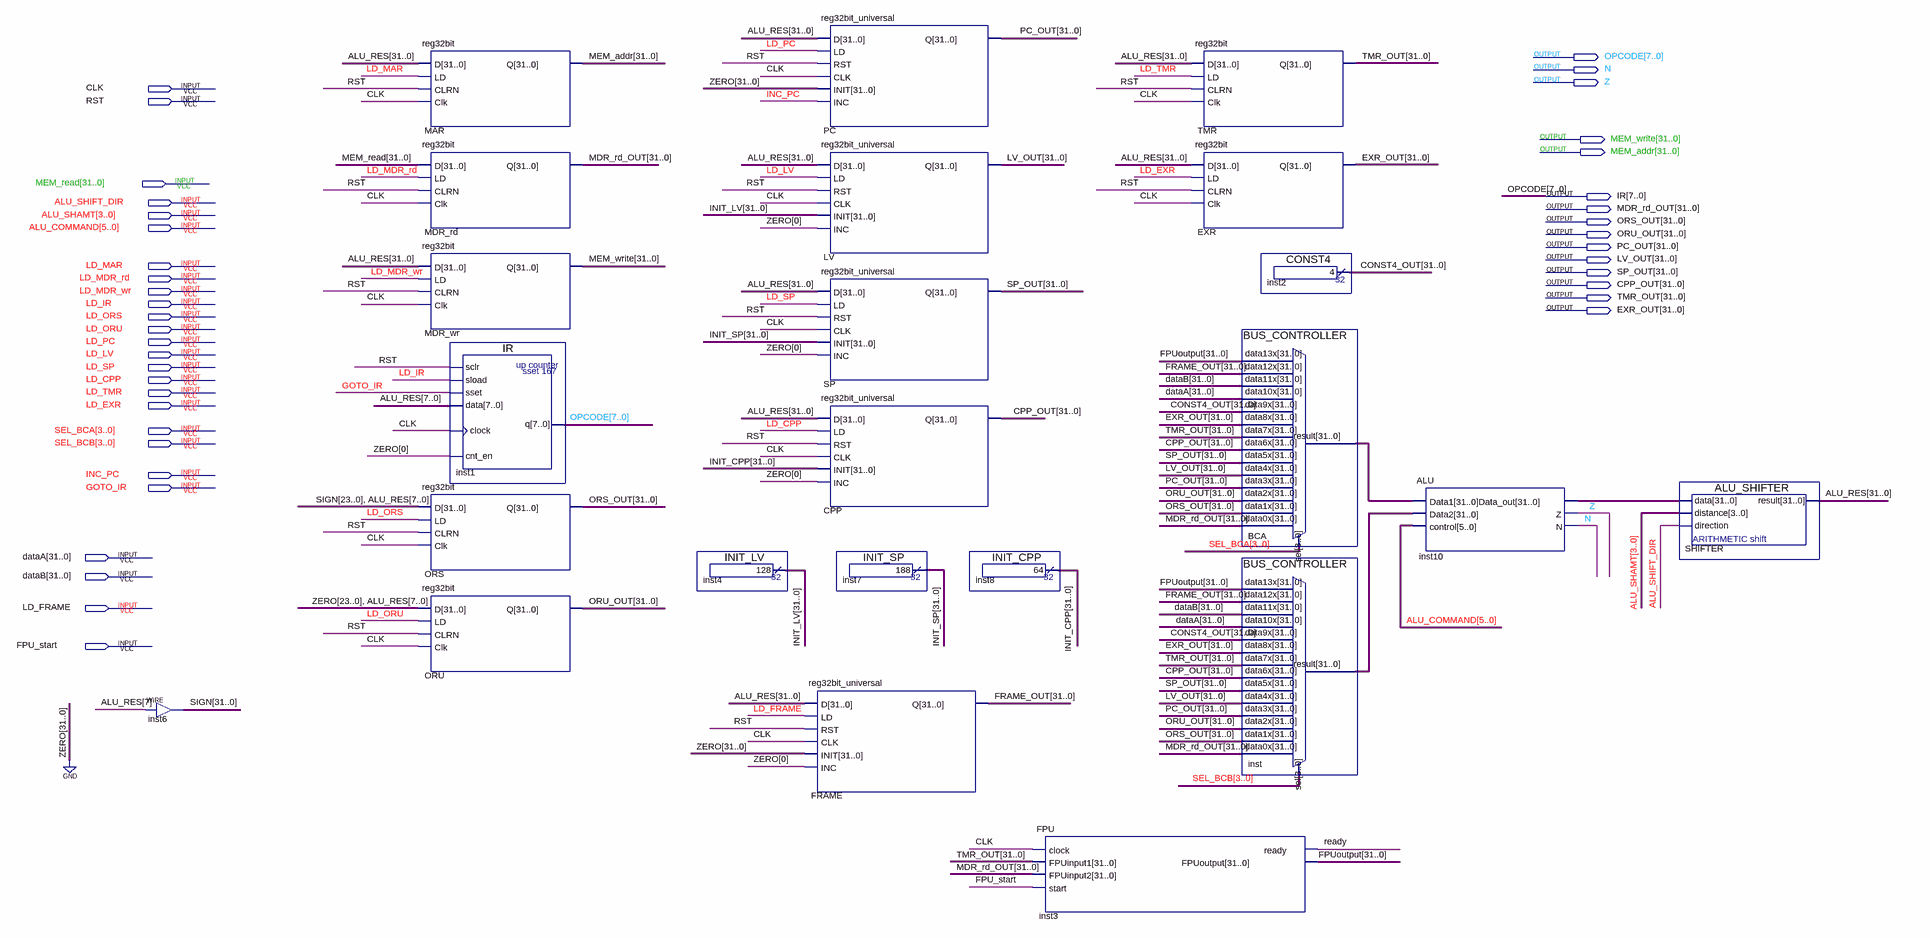
[diagram p0: schematic sheet]
// Quartus schematic DP.bdf as structural Verilog: 23 symbols, 41 pins
module DP (
  input  CLK,
  input  RST,
  input  [31:0] MEM_read,
  input  ALU_SHIFT_DIR,
  input  [3:0] ALU_SHAMT,
  input  [5:0] ALU_COMMAND,
  input  LD_MAR,
  input  LD_MDR_rd,
  input  LD_MDR_wr,
  input  LD_IR,
  input  LD_ORS,
  input  LD_ORU,
  input  LD_PC,
  input  LD_LV,
  input  LD_SP,
  input  LD_CPP,
  input  LD_TMR,
  input  LD_EXR,
  input  [3:0] SEL_BCA,
  input  [3:0] SEL_BCB,
  input  INC_PC,
  input  GOTO_IR,
  input  [31:0] dataA,
  input  [31:0] dataB,
  input  LD_FRAME,
  input  FPU_start,
  output [7:0] OPCODE,
  output N,
  output Z,
  output [31:0] MEM_write,
  output [31:0] MEM_addr,
  output [7:0] IR,
  output [31:0] MDR_rd_OUT,
  output [31:0] ORS_OUT,
  output [31:0] ORU_OUT,
  output [31:0] PC_OUT,
  output [31:0] LV_OUT,
  output [31:0] SP_OUT,
  output [31:0] CPP_OUT,
  output [31:0] TMR_OUT,
  output [31:0] EXR_OUT
);

  wire ready;
  wire [31:0] ALU_RES, BCA_result, CONST4_OUT, FPUoutput, FRAME_OUT, INIT_CPP, INIT_LV, INIT_SP,
       inst10_data_out, inst_result, SIGN;

  assign SIGN = {32{ALU_RES[7]}};  // WIRE inst6
  reg32bit MAR (.D(ALU_RES), .LD(LD_MAR), .CLRN(RST), .Clk(CLK), .Q(MEM_addr));
  reg32bit MDR_rd (.D(MEM_read), .LD(LD_MDR_rd), .CLRN(RST), .Clk(CLK), .Q(MDR_rd_OUT));
  reg32bit MDR_wr (.D(ALU_RES), .LD(LD_MDR_wr), .CLRN(RST), .Clk(CLK), .Q(MEM_write));
  reg32bit ORS (.D({SIGN[23:0], ALU_RES[7:0]}), .LD(LD_ORS), .CLRN(RST), .Clk(CLK), .Q(ORS_OUT));
  reg32bit ORU (.D({{24{1'b0}}, ALU_RES[7:0]}), .LD(LD_ORU), .CLRN(RST), .Clk(CLK), .Q(ORU_OUT));
  IR inst1 (.sclr(RST), .sload(LD_IR), .data(ALU_RES[7:0]), .sset(GOTO_IR), .clock(CLK), .cnt_en(1'b0), .q(IR));
  INIT_LV inst4 (.result(INIT_LV));
  reg32bit_universal PC (.D(ALU_RES), .LD(LD_PC), .RST(RST), .CLK(CLK), .INIT({32{1'b0}}), .INC(INC_PC), .Q(PC_OUT));
  reg32bit_universal LV (.D(ALU_RES), .LD(LD_LV), .RST(RST), .CLK(CLK), .INIT(INIT_LV), .INC(1'b0), .Q(LV_OUT));
  reg32bit_universal SP (.D(ALU_RES), .LD(LD_SP), .RST(RST), .CLK(CLK), .INIT(INIT_SP), .INC(1'b0), .Q(SP_OUT));
  reg32bit_universal CPP (.D(ALU_RES), .LD(LD_CPP), .RST(RST), .CLK(CLK), .INIT(INIT_CPP), .INC(1'b0), .Q(CPP_OUT));
  INIT_SP inst7 (.result(INIT_SP));
  reg32bit_universal FRAME (
    .D(ALU_RES), .LD(LD_FRAME), .RST(RST), .CLK(CLK), .INIT({32{1'b0}}), .INC(1'b0), .Q(FRAME_OUT));
  INIT_CPP inst8 (.result(INIT_CPP));
  FPU inst3 (
    .clock(CLK), .FPUinput1(TMR_OUT), .FPUinput2(MDR_rd_OUT), .start(FPU_start), .ready(ready),
    .FPUoutput(FPUoutput));
  reg32bit TMR (.D(ALU_RES), .LD(LD_TMR), .CLRN(RST), .Clk(CLK), .Q(TMR_OUT));
  reg32bit EXR (.D(ALU_RES), .LD(LD_EXR), .CLRN(RST), .Clk(CLK), .Q(EXR_OUT));
  BUS_CONTROLLER BCA (
    .data13x(FPUoutput), .data12x(FRAME_OUT), .data11x(dataB), .data10x(dataA), .data9x(CONST4_OUT),
    .data8x(EXR_OUT), .data7x(TMR_OUT), .data6x(CPP_OUT), .data5x(SP_OUT), .data4x(LV_OUT), .data3x(PC_OUT),
    .data2x(ORU_OUT), .data1x(ORS_OUT), .data0x(MDR_rd_OUT), .sel(SEL_BCA), .result(BCA_result));
  BUS_CONTROLLER inst (
    .data13x(FPUoutput), .data12x(FRAME_OUT), .data11x(dataB), .data10x(dataA), .data9x(CONST4_OUT),
    .data8x(EXR_OUT), .data7x(TMR_OUT), .data6x(CPP_OUT), .data5x(SP_OUT), .data4x(LV_OUT), .data3x(PC_OUT),
    .data2x(ORU_OUT), .data1x(ORS_OUT), .data0x(MDR_rd_OUT), .sel(SEL_BCB), .result(inst_result));
  CONST4 inst2 (.result(CONST4_OUT));
  ALU inst10 (.Data1(BCA_result), .Data2(inst_result), .control(ALU_COMMAND), .Data_out(inst10_data_out), .Z(Z), .N(N));
  ALU_SHIFTER SHIFTER (.data(inst10_data_out), .distance(ALU_SHAMT), .direction(ALU_SHIFT_DIR), .result(ALU_RES));

  assign OPCODE = IR;
endmodule
